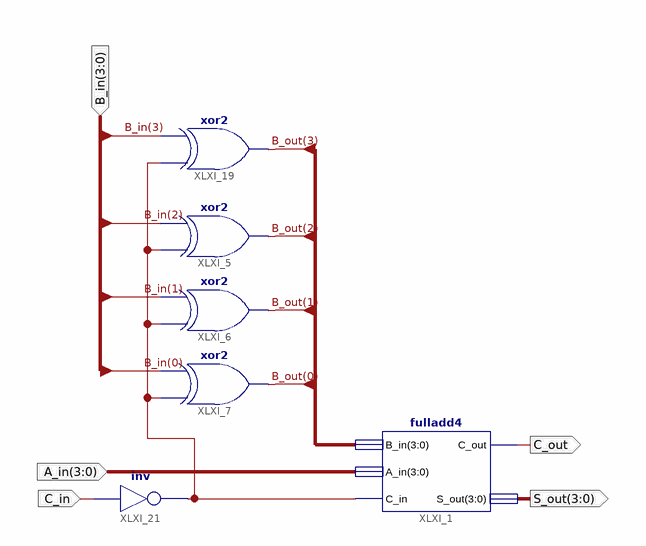
[diagram p0: schematic sheet 1]
// Xilinx ISE schematic Subtract.sch (spartan6) as structural Verilog: 6 symbols, 5 ports
module Subtract (
  input  [3:0] A_in,
  input  [3:0] B_in,
  input  C_in,
  output C_out,
  output [3:0] S_out
);

  wire XLXN_10;
  wire [3:0] B_out;

  xor XLXI_5 (B_out[2], XLXN_10, B_in[2]);
  xor XLXI_6 (B_out[1], XLXN_10, B_in[1]);
  xor XLXI_7 (B_out[0], XLXN_10, B_in[0]);
  fulladd4 XLXI_1 (.B_in(B_out), .A_in(A_in), .C_in(XLXN_10), .C_out(C_out), .S_out(S_out));
  not XLXI_21 (XLXN_10, C_in);
  xor XLXI_19 (B_out[3], XLXN_10, B_in[3]);
endmodule
